# Altium schematic sheet Saw VCO.SchDoc
size A3; SheetNumber: 2; SheetTotal: 4
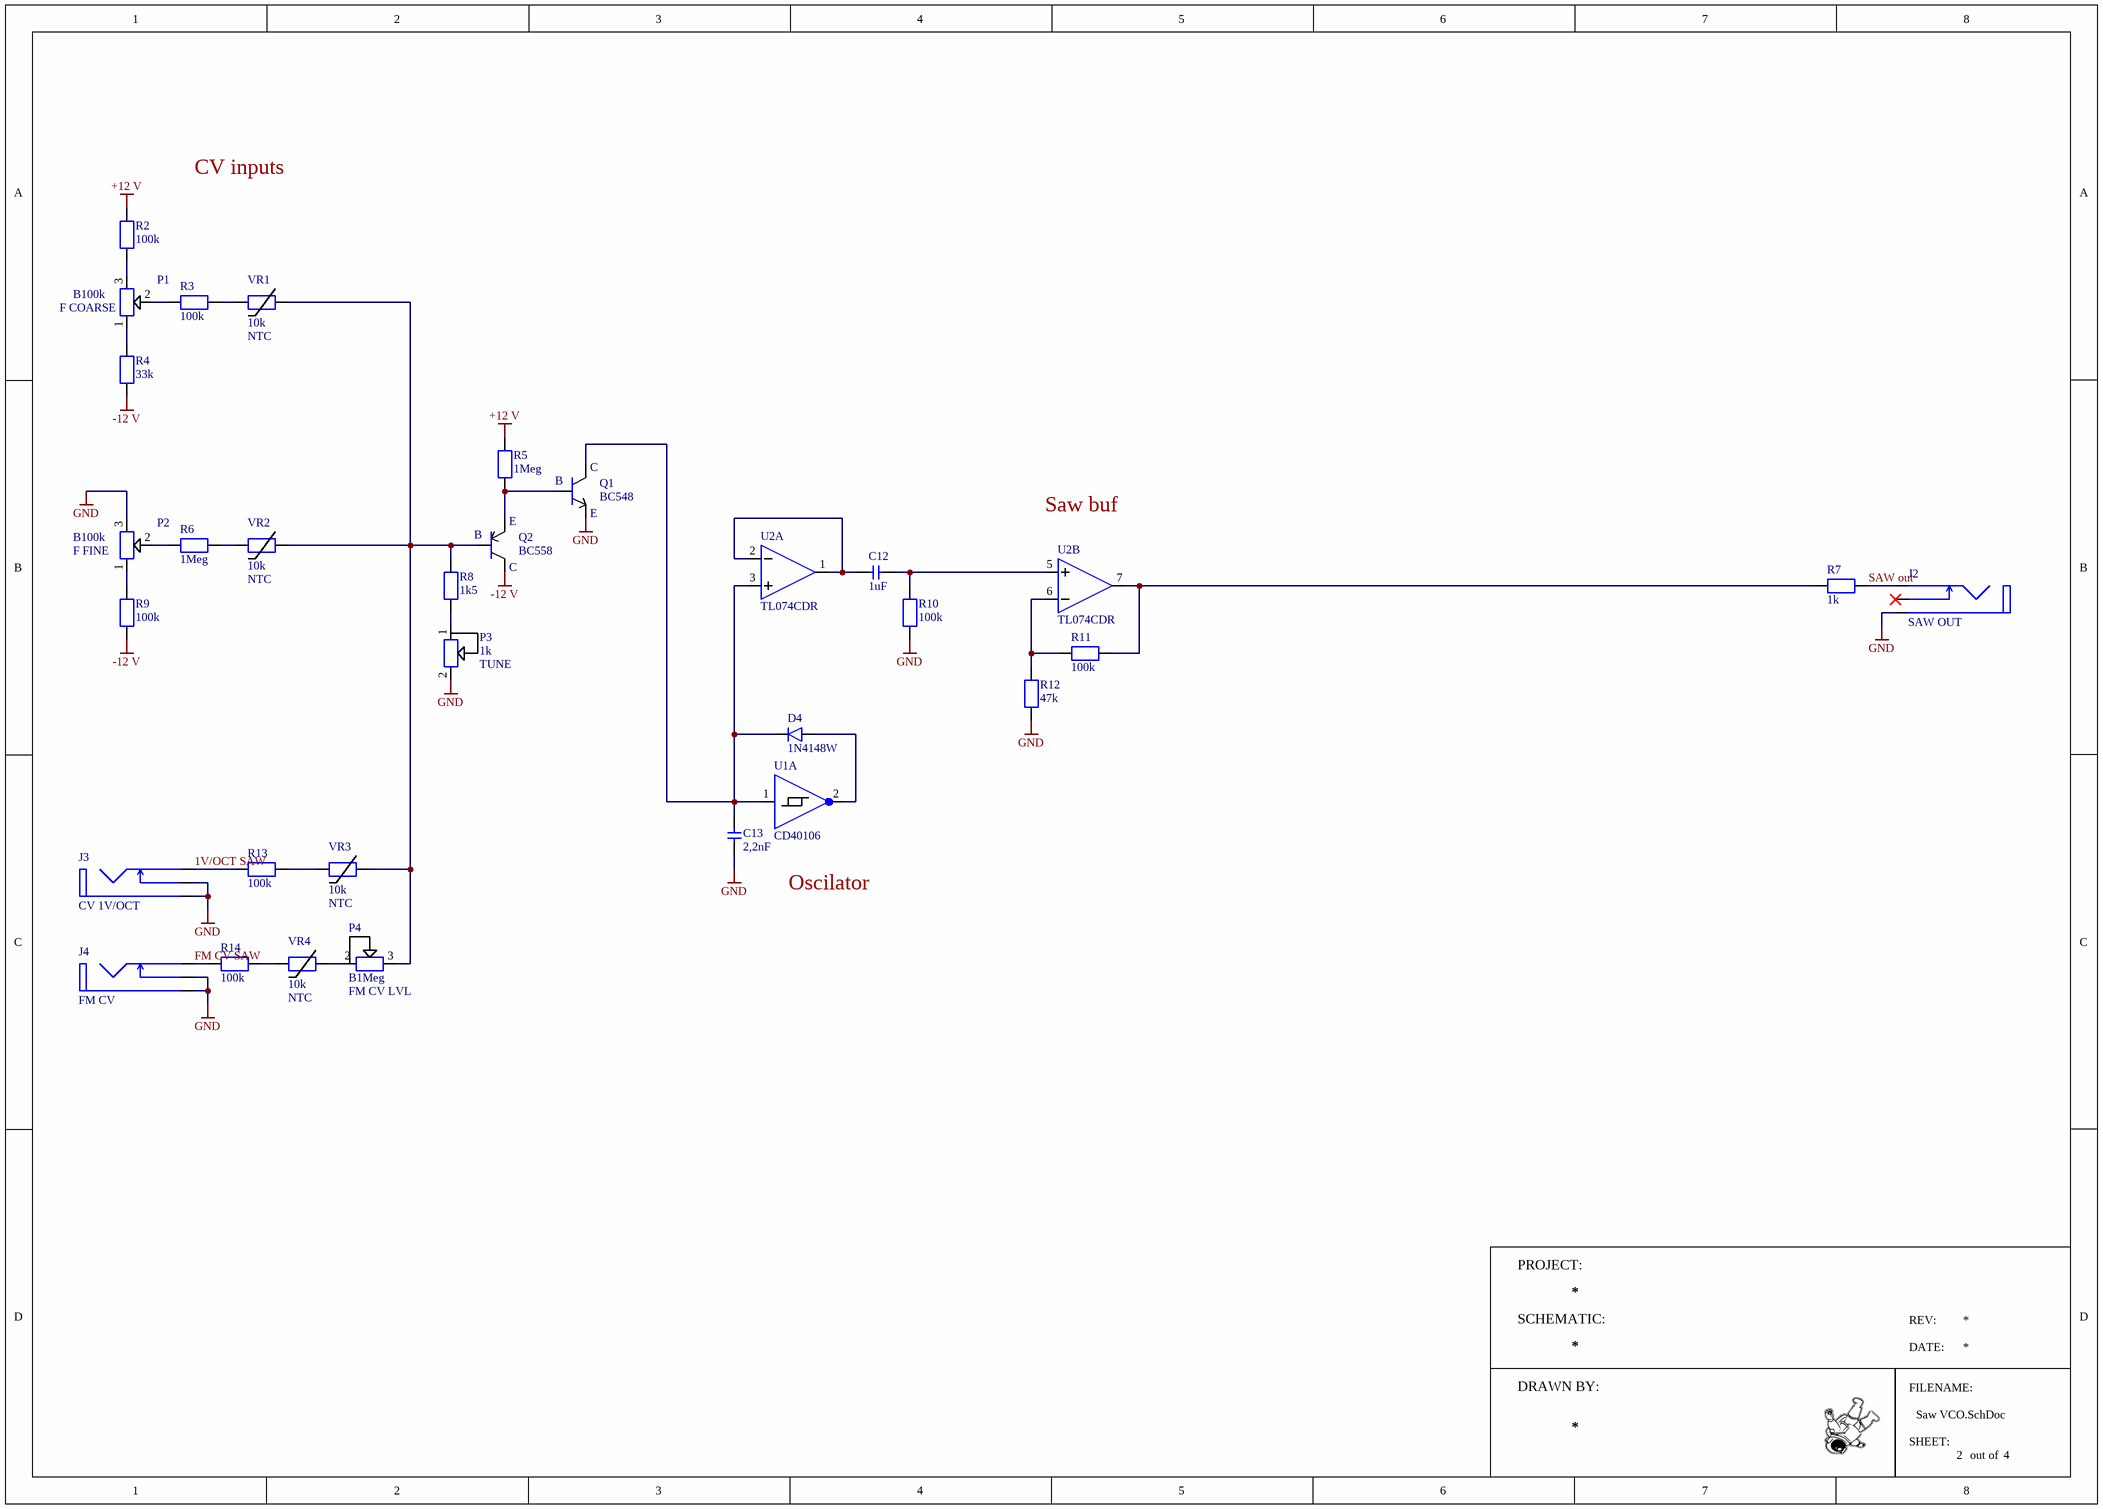
[diagram p0: Saw VCO.SchDoc]

## Parts
C12  value 1uF  [Cap SMD 0805]  (hidden comment: CAP)
C13  value 2,2nF  [Cap SMD 0805]  (hidden comment: CAP)
D4  Model: 1N4148W  [SOD-123]  (hidden comment: DIODE)
J2  Label: SAW OUT  [PJ301M]  (hidden comment: JACK Mono)
J3  Label: CV 1V/OCT  [PJ301M]  (hidden comment: JACK Mono)
J4  Label: FM CV  [PJ301M]  (hidden comment: JACK Mono)
P1  value B100k  Parameter: F COARSE  [9 mm PCB Potentiometer]  (hidden comment: Mono Pot)
P2  value B100k  Parameter: F FINE  [9 mm PCB Potentiometer]  (hidden comment: Mono Pot)
P3  value 1k  Parameter: TUNE  [Multiturn Potentiometer inline]  (hidden comment: VR)
P4  value B1Meg  Parameter: FM CV LVL  [9 mm PCB Potentiometer]  (hidden comment: VR)
Q1  BC548  [TO-92 wide]
Q2  BC558  [TO-92 wide]
R2  value 100k  [Resistor SMD 0805]  (hidden comment: RES)
R3  value 100k  [Resistor SMD 0805]  (hidden comment: RES)
R4  value 33k  [Resistor SMD 0805]  (hidden comment: RES)
R5  value 1Meg  [Resistor SMD 0805]  (hidden comment: RES)
R6  value 1Meg  [Resistor SMD 0805]  (hidden comment: RES)
R7  value 1k  [Resistor SMD 0805]  (hidden comment: RES)
R8  value 1k5  [Resistor SMD 0805]  (hidden comment: RES)
R9  value 100k  [Resistor SMD 0805]  (hidden comment: RES)
R10  value 100k  [Resistor SMD 0805]  (hidden comment: RES)
R11  value 100k  [Resistor SMD 0805]  (hidden comment: RES)
R12  value 47k  [Resistor SMD 0805]  (hidden comment: RES)
R13  value 100k  [Resistor SMD 0805]  (hidden comment: RES)
R14  value 100k  [Resistor SMD 0805]  (hidden comment: RES)
U1  CD40106  [DIP-14 socket]  (part A of 7)
U2  TL074CDR  [SOIC14]  (parts A,B of 5)
VR1  NTC  value 10k  [Thermistor SMD 0805]
VR2  NTC  value 10k  [Thermistor SMD 0805]
VR3  NTC  value 10k  [Thermistor SMD 0805]
VR4  NTC  value 10k  [Thermistor SMD 0805]

## Nets
+12 V: R2.2 R5.1
-12 V: Q2.1 R4.1 R9.1
GND: C13.1 J2.1 J3.1 J3.2 J4.1 J4.2 P2.3 P3.2 Q1.3 R10.2 R12.2
1V/OCT SAW: J3.3 R13.2
FM CV SAW: J4.3 R14.2
SAW out: J2.3 R7.2
NetC12_1: C12.1 R10.1 U2.5
NetC12_2: C12.2 U2.1 U2.2
NetC13_2: C13.2 D4.2 Q1.1 U1.1 U2.3
NetD4_1: D4.1 U1.2
NetP1_1: P1.1 R4.2
NetP1_2: P1.2 R3.2
NetP1_3: P1.3 R2.1
NetP2_1: P2.1 R9.2
NetP2_2: P2.2 R6.2
NetP3_1: P3.1 R8.2
NetP4_2: P4.2 VR4.2
NetP4_3: P4.3 Q2.2 R8.1 VR1.2 VR2.2 VR3.2
NetQ1_2: Q1.2 Q2.3 R5.2
NetR3_1: R3.1 VR1.1
NetR6_1: R6.1 VR2.1
NetR7_1: R7.1 R11.2 U2.7
NetR11_1: R11.1 R12.1 U2.6
NetR13_1: R13.1 VR3.1
NetR14_1: R14.1 VR4.1

Not connected (* = marked no-connect by the designer): J2 2*

## Notes on the sheet
- CV inputs
- Saw buf
- Oscilator
- PROJECT:
- SCHEMATIC:
- REV:
- DRAWN BY:
- DATE:
- FILENAME:
- SHEET:
- out of
- (in symbol BC548) C; B; E
- (in symbol BC558) E; B; C

## Library data of the parts
C12 C13 = Capacitor SMD 0805: SMD Capacitor Non-Polarised 0805 Package; Voltage rating: *; Tolerance: *; Package Type: SMD
D4 = Diode SMD SOD123: Generic SMD Diode SOD123 Package; Max reverse voltage: *; Max current: *; Forward voltage: *; Package Type: SMD; Type: Diode
J2-J4 = PJ301M: PJ301M Eurorack 3,5 mm Patch Socket PCB Mount; Package Type: THT
P1 P2 = Potentiometer 9 mm: PCB Mount 9mm Mono Potentiometer THT; Taper: *; Package Type: THT; Type: Potentiometer
P3 = VR A Multiturn THT: PCB Mount Multiturn Trimmer Potentiometer Top Adjustable as Variable Resistor Clockwise Increase; Taper: *; Package Type: THT; Type: Potentiometer
P4 = VR B 9 mm: PCB Mount 9mm Mono Potentiometer THT as Variable Resistor Clockwise Decrease; Taper: *; Package Type: THT; Type: Potentiometer
Q1 = BC548: BC548 NPN Transistor THT TO-92 Package; Package Type: THT; Type: NPN Transistor; Package: TO-92; Group: *
Q2 = BC558: BC558 PNP Transistor THT TO-92 Package; Package Type: THT; Type: PNP Transistor; Package: TO-92; Group: *
R2-R14 = Resistor SMD 0805: SMD Resistor 0805 package; Tolerance: *; Package Type: SMD
U1 = CD40106 DIP-14: CD40106 Hex Schmitt Trigger Inverter DIP-14 Package; Type: Schmitt Trigger; Package Type: THT; Package: DIP-14
U2 = TL074CDR SOIC14: TL074CDR Quad Op-Amp SOIC14 Package; Type: Op Amp; Package Type: SMD; Package: SOIC14
VR1-VR4 = Thermistor NTC SMD 0805: SMD NTC Thermistor 0805 package; Tolerance: *; Package Type: SMD